# Altium schematic sheet GlobalModule.SchDoc: Global Module
size A4; CompanyName: HEIG-VD; Organization: Institut d'Automatisation Industrielle; SheetNumber: 1; SheetTotal: 6; SheetFormat: A4; CurrentTime: 6; CurrentDate: 5; DocumentFullPathAndName: 8; DocumentName: 9; ModifiedDate: 13; ProjectName: <projet>
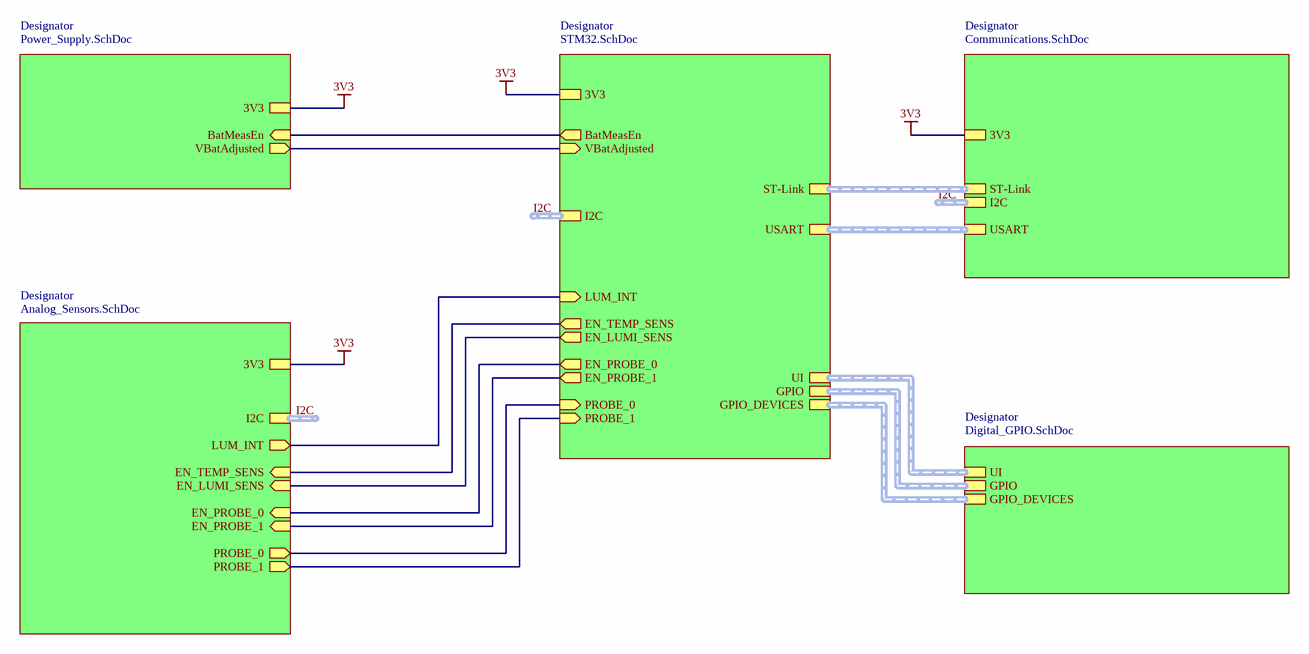
[diagram p0: GlobalModule.SchDoc]

## Sub-sheets
Designator = Power_Supply.SchDoc: 3V3, BatMeasEn (in), VBatAdjusted (out)
Designator = STM32.SchDoc: 3V3, ST-Link (harness ST-Link), I2C (harness I2C), PROBE_1 (in), PROBE_0 (in), EN_PROBE_0 (out), EN_PROBE_1 (out), LUM_INT (in), EN_LUMI_SENS (out), EN_TEMP_SENS (out), BatMeasEn (out), VBatAdjusted (in), USART (harness USART), UI (harness UI), GPIO (harness GPIO), GPIO_DEVICES (harness GPIO_DEVICES)
Designator = Analog_Sensors.SchDoc: EN_TEMP_SENS (in), I2C (harness I2C), EN_LUMI_SENS (in), 3V3, EN_PROBE_1 (in), EN_PROBE_0 (in), PROBE_1 (out), PROBE_0 (out), LUM_INT (out)
Designator = Communications.SchDoc: I2C (harness I2C), ST-Link (harness ST-Link), 3V3, USART (harness USART)
Designator = Digital_GPIO.SchDoc: UI (harness UI), GPIO (harness GPIO), GPIO_DEVICES (harness GPIO_DEVICES)

## Nets
3V3: sheet Designator/3V3, sheet Designator/3V3, sheet Designator/3V3, sheet Designator/3V3
(unnamed): sheet Designator/BatMeasEn, sheet Designator/BatMeasEn
(unnamed): sheet Designator/VBatAdjusted, sheet Designator/VBatAdjusted
(unnamed): sheet Designator/PROBE_1, sheet Designator/PROBE_1
(unnamed): sheet Designator/PROBE_0, sheet Designator/PROBE_0
(unnamed): sheet Designator/EN_PROBE_0, sheet Designator/EN_PROBE_0
(unnamed): sheet Designator/EN_PROBE_1, sheet Designator/EN_PROBE_1
(unnamed): sheet Designator/LUM_INT, sheet Designator/LUM_INT
(unnamed): sheet Designator/EN_LUMI_SENS, sheet Designator/EN_LUMI_SENS
(unnamed): sheet Designator/EN_TEMP_SENS, sheet Designator/EN_TEMP_SENS

## Buses and harness runs
harness I2C = sheet Designator/I2C

## Notes on the sheet
- Title
- HEIG-VD / TIN / IAI
  Route de Cheseaux, 1
  CH-1401 Yverdon-les-Bains
  http://iai.heig-vd.ch
  iai@heig-vd.ch
- Format
- Date
- Project Name
- VCS
- Author
- Version
- Review
- Checked by
- Project ID
- Page
- /
- File